# EAGLE design termometr (1) (EAGLE 7.4.0)
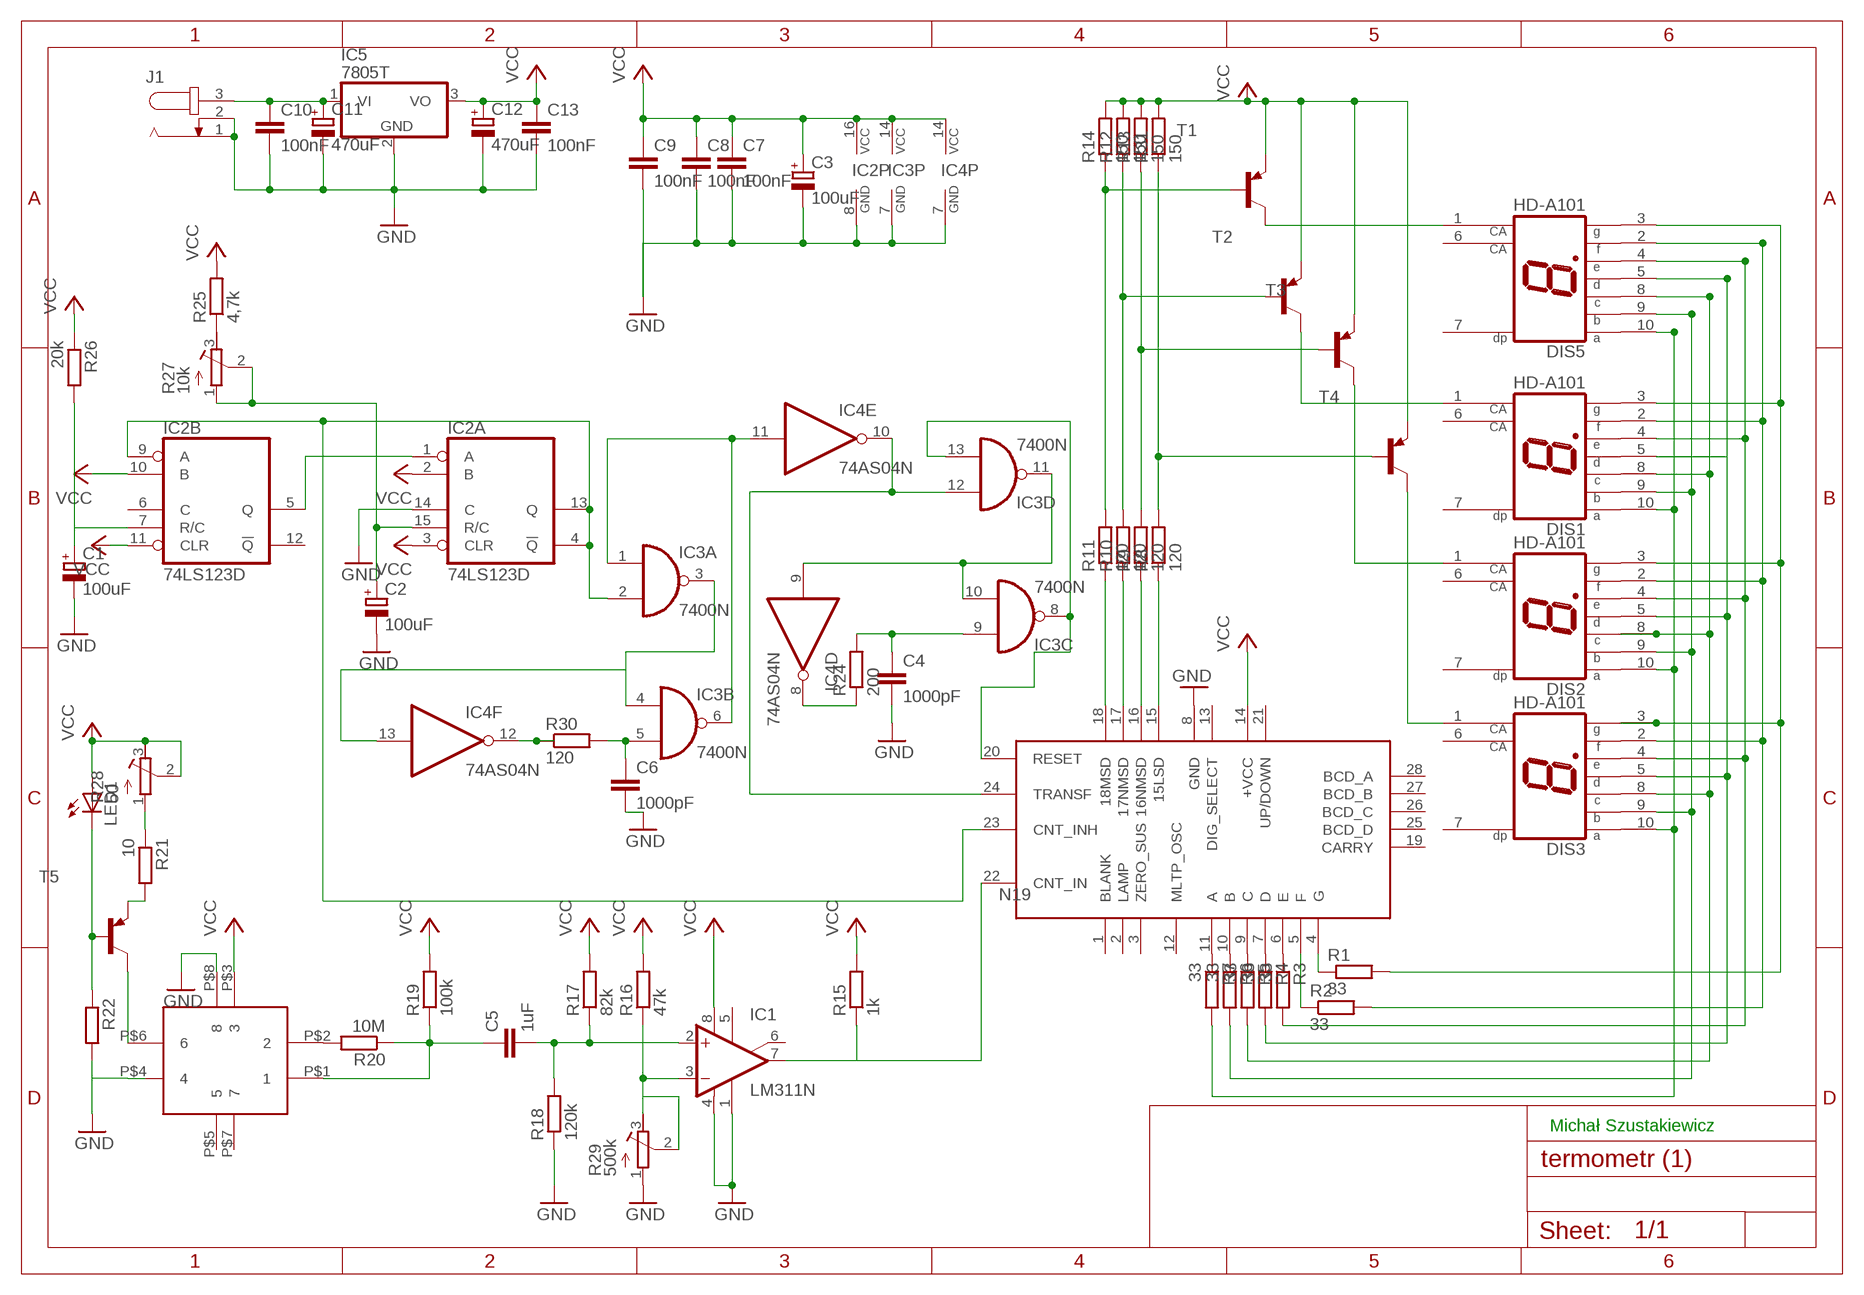
[diagram p0: schematic, sheet 1]

## Parts
C1  100uF  CPOL-EUE2.5-5  [E2,5-5]
C2  100uF  CPOL-EUE2.5-5  [E2,5-5]
C3  100uF  CPOL-EUE2.5-5  [E2,5-5]
C4  1000pF  C-EUC1206  [C1206]
C5  1uF  C-EUC1206  [C1206]
C6  1000pF  C-EUC1206  [C1206]
C7  100nF  C-EUC1206  [C1206]
C8  100nF  C-EUC1206  [C1206]
C9  100nF  C-EUC1206  [C1206]
C10  100nF  C-EUC1206  [C1206]
C11  470uF  CPOL-EUE2.5-5  [E2,5-5]
C12  470uF  CPOL-EUE2.5-5  [E2,5-5]
C13  100nF  C-EUC1206  [C1206]
DIS1  HD-A101  [HDSP-A]
DIS2  HD-A101  [HDSP-A]
DIS3  HD-A101  [HDSP-A]
DIS5  HD-A101  [HDSP-A]
IC1  LM311N  [DIL08]
IC2  74LS123D  [SO16]
IC3  7400N  [DIL14]
IC4  74AS04N  [DIL14]
IC5  7805T  [TO220H]
J1  JACK-PLUG0  [SPC4077]
LED1  LED5MM  [LED5MM]
R1  33  R-EU_M1206  [M1206]
R2  33  R-EU_M1206  [M1206]
R3  33  R-EU_M1206  [M1206]
R4  33  R-EU_M1206  [M1206]
R5  33  R-EU_M1206  [M1206]
R6  33  R-EU_M1206  [M1206]
R7  33  R-EU_M1206  [M1206]
R8  120  R-EU_M1206  [M1206]
R9  120  R-EU_M1206  [M1206]
R10  120  R-EU_M1206  [M1206]
R11  120  R-EU_M1206  [M1206]
R12  150  R-EU_M1206  [M1206]
R13  150  R-EU_M1206  [M1206]
R14  150  R-EU_M1206  [M1206]
R15  1k  R-EU_M1206  [M1206]
R16  47k  R-EU_M1206  [M1206]
R17  82k  R-EU_M1206  [M1206]
R18  120k  R-EU_M1206  [M1206]
R19  100k  R-EU_M1206  [M1206]
R20  10M  R-EU_M1206  [M1206]
R21  10  R-EU_M1206  [M1206]
R22  R-EU_M1206  [M1206]
R24  200  R-EU_M1206  [M1206]
R25  4,7k  R-EU_M1206  [M1206]
R26  20k  R-EU_M1206  [M1206]
R27  10k  R-TRIMM3202  [RTRIM3202]
R28  50  R-TRIMM3202  [RTRIM3202]
R29  500k  R-TRIMM3202  [RTRIM3202]
R30  120  R-EU_M1206  [M1206]
R31  150  R-EU_M1206  [M1206]
T1  2N3906-PNP-TO92-EBC  [TO92-EBC]
T2  2N3906-PNP-TO92-EBC  [TO92-EBC]
T3  2N3906-PNP-TO92-EBC  [TO92-EBC]
T4  2N3906-PNP-TO92-EBC  [TO92-EBC]
T5  2N3906-PNP-TO92-EBC  [TO92-EBC]
U$1  ZN1040E  [ZN1040E]
U$2  HEDS_1200  [HEDS_1200]

## Nets
15: R8.2 R31.1 T4.B
16: R9.2 R13.1 T3.B
17: R10.2 R12.1 T2.B
18: R11.2 R14.1 T1.B
GND: C1.- C2.- C3.- C4.2 C6.2 C7.2 C8.2 C9.2 C10.2 C11.- C12.- C13.2 IC1.1(GND) IC1.4(V-) IC2.8(P:GND) IC2.14(A:C) IC3.7(P:GND) IC4.7(P:GND) IC5.2(GND) J1.1 J1.2 R18.1 R22.2 R29.1(A) U$1.8(GND) U$2.P$4 U$2.P$8
N19: IC2.4(A:!Q) IC2.9(B:A) IC2.13(A:Q) IC3.2(A:I1) U$1.23(CNT_INH)
N$1: IC3.10(C:I1) IC3.11(D:O) IC4.9(D:I)
N$2: LED1.K(C) R22.1 T5.B
N$3: C1.+ IC2.7(B:R/C) R26.2
N$4: R21.1 R28.1(A)
N$5: R21.2 T5.E
N$6: C5.2 IC1.2(+IN) R17.1 R18.2
N$7: IC1.3(-IN) R16.1 R29.2(S) R29.3(E)
N$8: C5.1 R19.1 R20.1 U$2.P$1
N$9: R20.2 U$2.P$2
N$10: IC1.7(OUT) R15.1 U$1.22(CNT_IN)
N$11: C6.1 IC3.5(B:I1) R30.2
N$12: IC4.12(F:O) R30.1
N$13: C4.1 IC3.9(C:I0) R24.2
N$14: IC4.8(D:O) R24.1
N$15: C10.1 C11.+ IC5.1(VI) J1.3
N$16: IC3.1(A:I0) IC3.6(B:O) IC4.11(E:I)
N$17: IC3.12(D:I0) IC4.10(E:O) U$1.24(TRANSF)
N$18: DIS1.10(A) DIS2.10(A) DIS3.10(A) DIS5.10(A) R7.2
N$19: R1.1 U$1.4(G)
N$20: C2.+ IC2.15(A:R/C) R27.1(A) R27.2(S)
N$21: R25.1 R27.3(E)
N$22: DIS1.9(B) DIS2.9(B) DIS3.9(B) DIS5.9(B) R6.2
N$23: R2.1 U$1.5(F)
N$24: IC3.3(A:O) IC3.4(B:I0) IC4.13(F:I)
N$25: IC2.1(A:A) IC2.5(B:Q)
N$26: T5.C U$2.P$6
N$27: R3.1 U$1.6(E)
N$28: R4.1 U$1.7(D)
N$29: R5.1 U$1.9(C)
N$30: R6.1 U$1.10(B)
N$31: R7.1 U$1.11(A)
N$32: R11.1 U$1.18(18MSD)
N$33: R10.1 U$1.17(17NMSD)
N$34: R9.1 U$1.16(16NMSD)
N$35: R8.1 U$1.15(15LSD)
N$36: DIS1.8(C) DIS2.8(C) DIS3.8(C) DIS5.8(C) R5.2
N$37: DIS1.5(D) DIS2.5(D) DIS3.5(D) DIS5.5(D) R4.2
N$38: DIS1.4(E) DIS2.4(E) DIS3.4(E) DIS5.4(E) R3.2
N$39: DIS1.2(F) DIS2.2(F) DIS3.2(F) DIS5.2(F) R2.2
N$40: DIS1.3(G) DIS2.3(G) DIS3.3(G) DIS5.3(G) R1.2
N$41: DIS3.1(CA) T4.C
N$42: DIS2.1(CA) T3.C
N$43: DIS1.1(CA) T2.C
N$44: DIS5.1(CA) T1.C
RESET: IC3.8(C:O) IC3.13(D:I1) U$1.20(RESET)
VCC: C3.+ C7.1 C8.1 C9.1 C12.+ C13.1 IC1.8(V+) IC2.2(A:B) IC2.3(A:CLR) IC2.10(B:B) IC2.11(B:CLR) IC2.16(P:VCC) IC3.14(P:VCC) IC4.14(P:VCC) IC5.3(VO) LED1.A R12.2 R13.2 R14.2 R15.2 R16.2 R17.2 R19.2 R25.2 R26.1 R28.2(S) R28.3(E) R31.2 T1.E T2.E T3.E T4.E U$1.14(+VCC) U$2.P$3
Unconnected: DIS1.6(CA) DIS1.7(DP) DIS2.6(CA) DIS2.7(DP) DIS3.6(CA) DIS3.7(DP) DIS5.6(CA) DIS5.7(DP) IC1.5(ON) IC1.6(ON/STR) IC2.6(B:C) IC2.12(B:!Q) IC4.1(A:I) IC4.2(A:O) IC4.3(B:I) IC4.4(B:O) IC4.5(C:I) IC4.6(C:O) U$1.1(BLANK) U$1.2(LAMP) U$1.3(ZERO_SUS) U$1.12(MLTP_OSC) U$1.13(DIG_SELECT) U$1.19(CARRY) U$1.21(UP/DOWN) U$1.25(BCD_D) U$1.26(BCD_C) U$1.27(BCD_B) U$1.28(BCD_A) U$2.P$5 U$2.P$7

## Notes on the sheet
- Michał Szustakiewicz

## Library data of the parts
C1-C3 C11 C12 = rcl:CPOL-EU: POLARIZED CAPACITOR, European symbol
C4-C10 C13 = rcl:C-EU: CAPACITOR, European symbol
DIS1-DIS3 DIS5 = display-hp:HD-A101: LED DISPLAY 1-character 7 segment, decimal point right; OC_FARNELL: unknown; OC_NEWARK: unknown
IC1 = linear:LM311: COMPARATOR
IC2 = 74xx-eu:74*123: Retriggerable monostable MULTIVIBRATOR
IC3 = 74xx-eu:74*00: Quad 2-input NAND gate
IC4 = 74xx-eu:74*04: Hex INVERTER
IC5 = linear:78*: Positive VOLTAGE REGULATOR Source: http://cache.national.com/ds/LM/LM78L05.pdf http://www.fairchildsemi.com/ds/LM/LM7805.pdf
J1 = con-jack:JACK-PLUG: DC POWER JACK Power Jack, DC, Right Angle, Through Hole, Rated 5A at 16VDC, PC Terminals Distributor: Farnell (www.Farnell.de) Drawing: 84N1161.pdf / 84N1162.pdf Manufacturer: SPC Technology (www.spctechnology.com) Type: SPC4077 / SPC 4078; OC_FARNELL: unknown; OC_NEWARK: unknown
LED1 = led:LED: LED OSRAM: - CHIPLED LG R971, LG N971, LY N971, LG Q971, LY Q971, LO R971, LY R971 LH N974, LH R974 LS Q976, LO Q976, LY Q976 LO Q996 - Hyper CHIPLED LW Q18S LB Q993, LB Q99A, LB R99A - SideLED LS A670, LO A670, LY A670, LG A670, LP A670 LB A673, LV A673, LT A673, LW A673 LH A674 LY A675 LS A676, LA A676, LO A676, LY A676, LW A676 LS A679, LY A679, LG A679 - Hyper Micro SIDELED® LS Y876, LA Y876, LO Y876, LY Y876 LT Y87S - SmartLED LW L88C, LW L88S LB L89C, LB L89S, LG L890 LS L89K, LO L89K, LY L89K LS L896, LA L896, LO L896, LY L896 - TOPLED LS T670, LO T670, LY T670, LG T670, LP T670 LSG T670, LSP T670, LSY T670, LOP T670, LYG T670 LG T671, LOG T671, LSG T671 LB T673, LV T673, LT T673, LW T673 LH T674 LS T676, LA T676, LO T676, LY T676, LB T676, LH T676, LSB T676, LW T676 LB T67C, LV T67C, LT T67C, LS T67K, LO T67K, LY T67K, LW E67C LS E67B, LA E67B, LO E67B, LY E67B, LB E67C, LV E67C, LT E67C LW T67C LS T679, LY T679, LG T679 LS T770, LO T770, LY T770, LG T770, LP T770 LB T773, LV T773, LT T773, LW T773 LH T774 LS E675, LA E675, LY E675, LS T675 LS T776, LA T776, LO T776, LY T776, LB T776 LHGB T686 LT T68C, LB T68C - Hyper Mini TOPLED® LB M676 - Mini TOPLED Santana® LG M470 LS M47K, LO M47K, LY M47K Source: http://www.osram.convergy.de LUXEON: - LUMILED® LXK2-PW12-R00, LXK2-PW12-S00, LXK2-PW14-U00, LXK2-PW14-V00 LXK2-PM12-R00, LXK2-PM12-S00, LXK2-PM14-U00 LXK2-PE12-Q00, LXK2-PE12-R00, LXK2-PE12-S00, LXK2-PE14-T00, LXK2-PE14-U00 LXK2-PB12-K00, LXK2-PB12-L00, LXK2-PB12-M00, LXK2-PB14-N00, LXK2-PB14-P00, LXK2-PB14-Q00 LXK2-PR12-L00, LXK2-PR12-M00, LXK2-PR14-Q00, LXK2-PR14-R00 LXK2-PD12-Q00, LXK2-PD12-R00, LXK2-PD12-S00 LXK2-PH12-R00, LXK2-PH12-S00 LXK2-PL12-P00, LXK2-PL12-Q00, LXK2-PL12-R00 Source: www.luxeon.com KINGBRIGHT: KA-3528ASYC Source: www.kingbright.com
R1-R22 R24-R26 R30 R31 = rcl:R-EU_: RESISTOR, European symbol
R27-R29 = rcl:R-TRIMM: Trimm resistor
T1-T5 = transistor-neu-to92:*-PNP-: PNP Transistror
U$1 = zn1040e (1):ZN1040E
U$2 = heds_1200:HEDS_1200

## Net classes
0 default: width 0.4 mm, clearance 0.4 mm

## Board
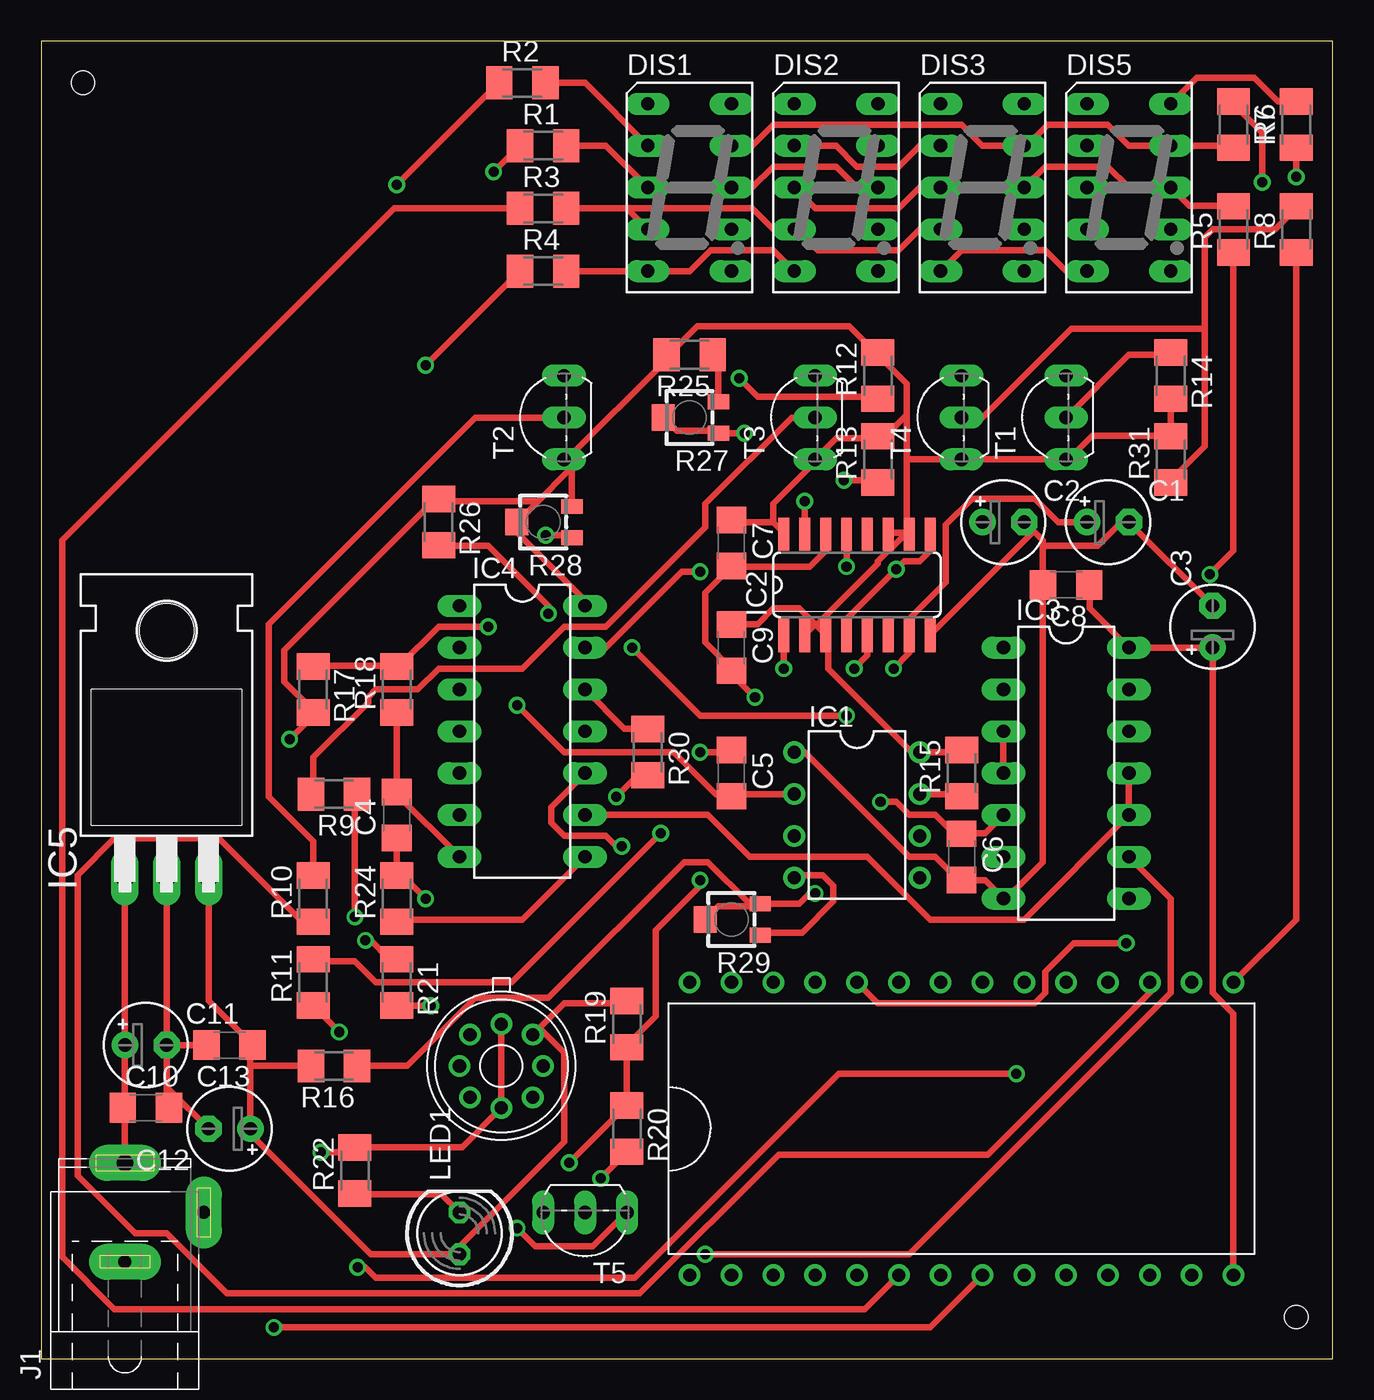
[diagram p1: board, top side]
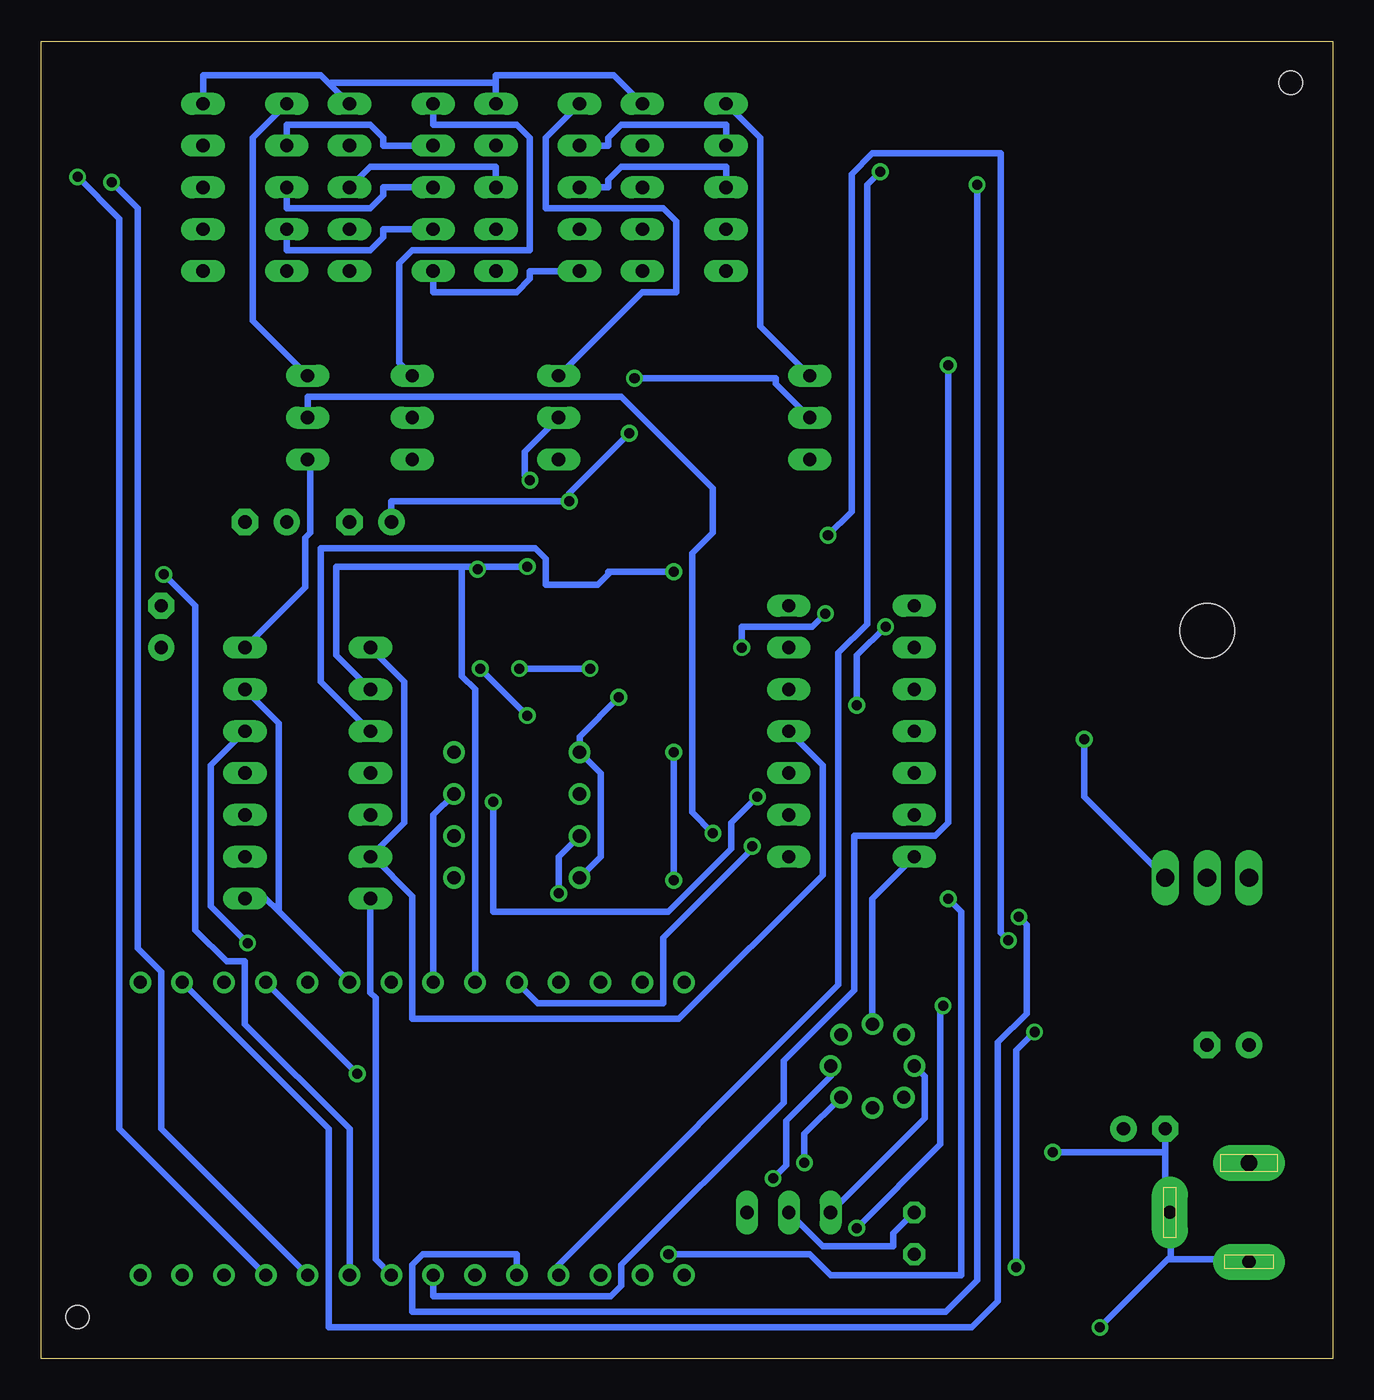
[diagram p2: board, bottom side, seen from below]

Size 78.41 x 80 mm. Coordinates in mm from the lower left corner, seen from the top.
Outline: 0,0 78.41,0 78.41,80 0,80 0,0
Copper layers (1*16): Top 0.035mm / dielectric 1.5mm / Bottom 0.035mm
Design rules "default": minimum track width 10mil, minimum drill 24mil, track to track 8mil, track to pad 8mil, pad to pad 8mil, via to via 8mil, smd to smd 8mil, copper to edge 40mil, drill to drill 8mil, minimum pad ring 10mil, minimum via ring 8mil, stop-mask expansion 4mil, vias tented up to drill 0mil, thermal gap 10mil
Holes 1.4 mm at 2.54,77.47 76.2,2.54

### Footprints (pad centres in the part's own frame; a part is rotated, then mirrored left to right if it is on the bottom)
E2,5-5 = drill 0.813 pad 1.6: + -1.27,0 | drill 0.813 pad 1.6 octagon: - 1.27,0
C1206 = smd 1.6 x 1.8: 1 -1.4,0; 2 1.4,0
HDSP-A = drill 0.813 long: 1 -2.54,5.08; 2 -2.54,2.54; 3 -2.54,0; 4 -2.54,-2.54; 5 -2.54,-5.08; 6 2.54,-5.08; 7 2.54,-2.54; 8 2.54,0; 9 2.54,2.54; 10 2.54,5.08
DIL08 = drill 0.813 pad 1.27: 1 -3.81,-3.81; 2 -1.27,-3.81; 3 1.27,-3.81; 4 3.81,-3.81; 5 3.81,3.81; 6 1.27,3.81; 7 -1.27,3.81; 8 -3.81,3.81
SO16 = smd 0.66 x 2.032: 1 -4.445,-3.073; 2 -3.175,-3.073; 3 -1.905,-3.073; 4 -0.635,-3.073; 5 0.635,-3.073; 6 1.905,-3.073; 7 3.175,-3.073; 8 4.445,-3.073; 9 4.445,3.073; 10 3.175,3.073; 11 1.905,3.073; 12 0.635,3.073; 13 -0.635,3.073; 14 -1.905,3.073; 15 -3.175,3.073; 16 -4.445,3.073
DIL14 = drill 0.813 long: 1 -7.62,-3.81; 2 -5.08,-3.81; 3 -2.54,-3.81; 4 0,-3.81; 5 2.54,-3.81; 6 5.08,-3.81; 7 7.62,-3.81; 8 7.62,3.81; 9 5.08,3.81; 10 2.54,3.81; 11 0,3.81; 12 -2.54,3.81; 13 -5.08,3.81; 14 -7.62,3.81
TO220H = drill 1.118 long: 1 -2.54,-10.16; 2 0,-10.16; 3 2.54,-10.16 | hole 3.302: 0,4.826
SPC4077 = drill 0.8 pad 2.184 long: 1 -3,0; 2 0,-4.8 | drill 1 pad 2.184 long: 3 3,0
LED5MM = drill 0.813 octagon: A -1.27,0; K 1.27,0
M1206 = smd 1.6 x 2: 1 -1.4,0; 2 1.4,0
RTRIM3202 = smd 0.9 x 1.3: 1 -0.95,-1.75; 3 0.95,-1.75 | smd 1.6 x 1.4: 2 0,1.6
TO92-EBC = drill 0.813 long: B 0,-1.27; C 2.54,-1.27; E -2.54,-1.27
ZN1040E = drill 0.8: 1 1.27,-1.27; 2 3.81,-1.27; 3 6.35,-1.27; 4 8.89,-1.27; 5 11.43,-1.27; 6 13.97,-1.27; 7 16.51,-1.27; 8 19.05,-1.27; 9 21.59,-1.27; 10 24.13,-1.27; 11 26.67,-1.27; 12 29.21,-1.27; 13 31.75,-1.27; 14 34.29,-1.27; 15 34.29,16.51; 16 31.75,16.51; 17 29.21,16.51; 18 26.67,16.51; 19 24.13,16.51; 20 21.59,16.51; 21 19.05,16.51; 22 16.51,16.51; 23 13.97,16.51; 24 11.43,16.51; 25 8.89,16.51; 26 6.35,16.51; 27 3.81,16.51; 28 1.27,16.51
HEDS_1200 = drill 0.8: P$1 -1.905,1.905; P$2 -2.54,0; P$3 -1.905,-1.905; P$4 0,-2.54; P$5 1.905,-1.905; P$6 2.54,0; P$7 1.905,1.905; P$8 0,2.54

### Placement (x,y rotation side)
C1  64.77,50.8 0 top
C2  58.42,50.8 0 top
C3  71.12,44.45 90 top
C4  21.59,33.02 90 top
C5  41.91,35.56 270 top
C6  55.88,30.48 270 top
C7  41.91,49.53 270 top
C8  62.23,46.99 180 top
C9  41.91,43.18 270 top
C10  6.35,15.24 0 top
C11  6.35,19.05 0 top
C12  11.43,13.97 180 top
C13  11.43,19.05 180 top
DIS1  39.37,71.12 0 top
DIS2  48.26,71.12 0 top
DIS3  57.15,71.12 0 top
DIS5  66.04,71.12 0 top
IC1  49.53,33.02 270 top
IC2  49.53,46.99 0 top
IC3  62.23,35.56 270 top
IC4  29.21,38.1 270 top
IC5  7.62,39.37 0 top
J1  5.08,8.89 90 top
LED1  25.4,7.62 90 top
R1  30.48,73.66 0 top
R2  29.21,77.47 0 top
R3  30.48,69.85 0 top
R4  30.48,66.04 0 top
R5  72.39,68.58 90 top
R6  72.39,74.93 270 top
R7  76.2,74.93 90 top
R8  76.2,68.58 90 top
R9  17.78,34.29 180 top
R10  16.51,27.94 90 top
R11  16.51,22.86 90 top
R12  50.8,59.69 90 top
R13  50.8,54.61 90 top
R14  68.58,59.69 270 top
R15  55.88,35.56 90 top
R16  17.78,17.78 180 top
R17  16.51,40.64 270 top
R18  21.59,40.64 90 top
R19  35.56,20.32 90 top
R20  35.56,13.97 270 top
R21  21.59,22.86 270 top
R22  19.05,11.43 90 top
R24  21.59,27.94 90 top
R25  39.37,60.96 180 top
R26  24.13,50.8 270 top
R27  39.37,57.15 90 top
R28  30.48,50.8 90 top
R29  41.91,26.67 90 top
R30  36.83,36.83 270 top
R31  68.58,54.61 90 top
T1  60.96,57.15 90 top
T2  30.48,57.15 90 top
T3  45.72,57.15 90 top
T4  54.61,57.15 90 top
T5  33.02,7.62 180 top
U$1  38.1,6.35 0 top
U$2  27.94,17.78 180 top

### Tracks (layer width: path | path; a pad name or v marks a point on that pad's centre or on a via)
15
  Top 0.4: 70.64,62.55 70.64,68.1 71.12,68.58 74.93,68.58 76.2,69.85 R8.2 | 70.64,62.55 70.64,55.4 68.58,53.34 R31.1 | T4.B 57.15,57.15 62.55,62.55 70.64,62.55
16  (via drill 0.61)
  Top 0.4: T3.B 45.56,57.15 40.32,51.91 40.32,50.48 34.29,44.45 31.75,44.45 29.21,41.91 24.13,41.91 22.86,40.64 20.32,40.64 19.84,40.16 19.84,39.85 16.51,36.51 16.51,34.29 R9.2 | v48.74,53.34 50.8,53.34 R13.1
  Bottom 0.4: v48.74,53.34 49.05,53.66 49.05,55.09 T3.B
17  (via drill 0.61)
  Top 0.4: R10.2 16.51,31.43 13.81,34.13 13.81,44.61 26.35,57.15 T2.B | v42.39,59.53 43.5,58.42 50.8,58.42 R12.1
  Bottom 0.4: v42.39,59.53 33.81,59.53 33.81,59.21 T2.B
18  (via drill 0.61)
  Top 0.4: v37.62,31.91 28.57,22.86 20.32,22.86 19.05,24.13 16.51,24.13 R11.2 | T1.B 66.04,60.96 68.58,60.96 R14.1
  Bottom 0.4: v37.62,31.91 38.89,33.18 38.89,48.9 37.62,50.16 37.62,52.86 43.18,58.42 62.23,58.42 T1.B
GND  (via drill 0.61)
  Top 0.4: C11.- 7.62,16.35 | 7.62,16.35 7.62,15.24 C10.2 | C11.- C13.2 | C12.- 7.78,16.35 7.62,16.35 | C11.- IC5.2 | R18.1 C4.2 21.59,34.29 IC4.7 | U$2.P$4 U$2.P$8 25.56,12.86 19.05,12.86 R22.2 18.89,12.86 18.57,12.54 v16.99,12.54 | C3.- C1.- 65.56,50.8 64.13,49.37 60.8,49.37 | 60.8,49.37 60.8,49.69 C2.- 60.17,50.16 53.97,43.97 IC2.8 | 60.8,49.37 60.8,46.99 C8.2 60.8,46.83 60.8,30.16 58.58,27.94 IC3.7 57.31,29.05 55.88,29.05 C6.2 55.72,29.05 54.29,30.48 52.7,30.48 46.35,36.83 IC1.1 | IC2.14 47.62,49.05 46.67,48.1 42.07,48.1 C7.2 41.91,48.1 40.32,46.51 40.32,43.5 41.91,41.91 C9.2 41.91,41.59 v43.34,40.16 | IC1.4 45.88,29.37 47.47,29.37 48.1,28.73 48.1,27.78 46.2,25.88 43.81,25.88 R29.1 | v14.13,1.91 53.97,1.91 U$1.8
  Bottom 0.4: 9.84,6.03 5.08,6.03 J1.1 | 9.84,6.03 9.84,8.89 J1.2 10,9.05 10.16,9.21 10.16,12.54 | C12.- 10.16,12.54 | IC4.7 27.94,27.94 U$2.P$4 | v16.99,12.54 10.16,12.54 | IC1.4 44.45,30.48 44.45,35.56 IC1.1 45.72,37.78 v43.34,40.16 | U$1.8 58.1,6.03 58.1,21.91 58.42,22.23 IC3.7 | v14.13,1.91 10,6.03 9.84,6.03
N19  (via drill 0.61)
  Top 0.4: IC2.4 48.89,44.93 v51.91,47.94 52.39,48.42 53.34,48.42 53.97,49.05 IC2.9 | v48.89,48.1 IC2.13
  Bottom 0.4: 52.86,48.1 60.48,48.1 60.48,42.7 IC3.2 | 52.86,48.1 51.91,48.1 | 51.91,48.1 v48.89,48.1 | U$1.23 52.07,40.64 52.86,41.43 52.86,48.1 | v51.91,47.94 51.91,48.1
N$1
  Top 0.4: IC4.9 40.48,33.02 43.02,30.48 50.16,30.48 53.97,26.67 59.69,26.67 IC3.10 IC3.11
N$2
  Top 0.4: LED1.K 24.29,10 19.05,10 R22.1
  Bottom 0.4: T5.B 30.96,6.83 26.67,6.83 26.67,7.62 LED1.K
N$3  (via drill 0.61)
  Top 0.4: v30.8,45.24 30.8,45.72 27.15,49.37 24.13,49.37 R26.2 | v35.88,43.18 40,39.05 v48.89,39.05 | v51.75,41.91 52.7,42.86 IC2.7 52.86,43.97 52.86,45.09 54.93,47.15 54.93,50.64 56.52,52.23 60.33,52.23 61.75,50.8 C1.+
  Bottom 0.4: v30.8,45.24 31.59,44.45 35.88,44.45 v35.88,43.18 | v51.75,41.91 v48.89,39.05
N$4  (via drill 0.61)
  Top 0.4: v30.64,50.01 32.23,50.01 R28.1 | v19.68,25.4 20,25.4 21.11,24.29 21.59,24.29 R21.1
  Bottom 0.4: v30.64,50.01 29.21,51.44 29.21,71.91 27.94,73.18 20.16,73.18 20.16,25.88 v19.68,25.4
N$5  (via drill 0.61)
  Top 0.4: v23.65,21.43 21.59,21.43 R21.2 | v28.89,7.94 30,6.83 33.5,6.83 T5.E
  Bottom 0.4: v23.65,21.43 23.81,21.27 23.81,13.02 v28.89,7.94
N$6  (via drill 0.61)
  Top 0.4: R17.1 16.51,42.07 21.59,42.07 R18.2 21.75,42.07 24.13,44.45 v27.15,44.45 | IC1.2 41.91,34.29 C5.2 41.75,34.29 40.96,34.29 38.42,36.83 31.75,36.83 v28.89,39.69
  Bottom 0.4: v27.15,44.45 28.89,42.7 v28.89,39.69
N$7  (via drill 0.61)
  Top 0.4: R29.3 43.66,27.46 41.12,27.46 40.32,26.67 R29.2 | R16.1 22.22,17.78 26.35,21.91 30.8,21.91 39.05,30.16 40.48,30.16 43.02,27.62 R29.3 | v46.99,28.26 46.67,28.26 46.04,27.62 43.81,27.62 R29.3
  Bottom 0.4: IC1.3 46.99,30.48 v46.99,28.26
N$8  (via drill 0.61)
  Top 0.4: v40,36.83 41.91,36.83 C5.1 | v40,29.05 40,28.73 37.31,26.04 37.31,20.8 35.56,19.05 R19.1 35.56,15.4 | 35.56,15.4 v32.07,11.91 | 35.56,15.4 R20.1
  Bottom 0.4: v40,29.05 v40,36.83 | U$2.P$1 32.07,13.65 v32.07,11.91
N$9  (via drill 0.61)
  Top 0.4: v33.97,10.95 35.56,12.54 R20.2
  Bottom 0.4: v33.97,10.95 33.18,11.75 33.18,14.45 30.48,17.14 U$2.P$2
N$10
  Top 0.4: IC1.7 55.88,34.29 R15.1
  Bottom 0.4: U$1.22 54.61,33.02 IC1.7
N$11  (via drill 0.61)
  Top 0.4: IC3.5 57.31,31.91 55.88,31.91 C6.1 55.72,31.91 55.4,31.91 54.29,33.02 52.7,33.02 51.91,33.81 v50.96,33.81 | v34.92,34.13 36.19,35.4 36.83,35.4 R30.2
  Bottom 0.4: v34.92,34.13 36.51,32.54 36.51,30.96 40.32,27.15 50.96,27.15 v50.96,33.81
N$12
  Top 0.4: IC4.12 35.4,38.26 36.83,38.26 R30.1
N$13  (via drill 0.61)
  Top 0.4: C4.1 R24.2 21.75,29.53 v23.34,27.94 | IC3.9 68.58,27.94 68.58,22.23 52.7,6.35 v40.32,6.35
  Bottom 0.4: v40.32,6.35 31.75,6.35 30.48,5.08 22.54,5.08 22.54,27.15 v23.34,27.94
N$14
  Top 0.4: IC4.8 29.21,26.67 21.59,26.67 R24.1
N$15
  Top 0.4: J1.3 5.08,15.24 C10.1 5.08,15.4 C11.+ IC5.1
N$16
  Bottom 0.4: IC3.1 56.36,41.12 56.36,32.54 IC3.6 58.26,30.48 55.88,28.1 55.88,20.64 39.69,20.64 30.96,29.37 30.96,36.04 IC4.11
N$17  (via drill 0.61)
  Top 0.4: v35.24,31.11 34.92,31.11 34.29,31.75 31.75,31.75 30.96,32.54 30.96,33.5 IC4.10 | v65.88,25.24 62.71,25.24 60.96,23.5 60.96,22.23 60.33,21.59 50.8,21.59 U$1.24
  Bottom 0.4: U$1.24 48.26,21.59 40.64,21.59 40.64,25.56 35.24,30.96 v35.24,31.11 | IC3.12 68.1,36.04 68.1,27.46 v65.88,25.24
N$18
  Top 0.4: DIS5.10 70.17,77.79 73.66,77.79 75.09,76.36 76.2,76.36 R7.2
  Bottom 0.4: DIS1.10 43.66,77.95 50.8,77.95 50.8,77.47 | DIS2.10 50.8,77.47 | 60.88,77.39 61.44,77.95 68.58,77.95 DIS5.10 | 60.88,77.39 DIS3.10 | 50.8,77.47 60.8,77.47 60.88,77.39
N$19  (via drill 0.61)
  Top 0.4: v27.46,72.07 29.05,73.66 R1.1
  Bottom 0.4: v27.46,72.07 28.26,71.28 28.26,44.61 30,42.86 30,22.7 46.99,5.71 U$1.4
N$20  (via drill 0.61)
  Top 0.4: R27.2 37.78,57.15 38.58,56.36 41.12,56.36 R27.1 41.28,56.2 v42.7,56.2 | v46.35,52.07 IC2.15
  Bottom 0.4: C2.+ 57.15,52.07 v46.35,52.07 46.35,52.55 v42.7,56.2
N$21
  Top 0.4: R27.3 41.12,60.64 40.8,60.96 R25.1
N$22
  Top 0.4: R6.2 72.39,73.66 DIS5.9 66.04,73.66 64.77,74.93 61.12,74.93 59.85,73.66 DIS3.9 57.15,73.66 55.88,74.93 49.53,74.93 | DIS1.9 43.18,73.66 44.45,74.93 49.53,74.93 | DIS2.9 49.53,74.93
N$23  (via drill 0.61)
  Top 0.4: v21.59,71.28 27.78,77.47 R2.1
  Bottom 0.4: v21.59,71.28 21.59,4.76 23.5,2.86 55.88,2.86 55.88,5.71 55.24,6.35 49.53,6.35 U$1.5
N$24  (via drill 0.61)
  Top 0.4: IC3.3 IC3.4 | IC4.13 34.29,43.18 38.89,47.78 v40,47.78
  Bottom 0.4: v40,47.78 43.97,47.78 43.97,47.62 44.61,46.99 47.78,46.99 47.78,48.58 48.42,49.21 61.44,49.21 61.44,41.12 IC3.3
N$25  (via drill 0.61)
  Top 0.4: v45.08,41.91 IC2.1 | v49.37,41.91 50.16,42.7 IC2.5
  Bottom 0.4: v49.37,41.91 v45.08,41.91
N$26
  Bottom 0.4: U$2.P$6 24.76,17.14 24.76,14.61 T5.C
N$27
  Top 0.4: 1.27,49.69 1.27,6.19 4.45,3.02 50.01,3.02 U$1.6 | 29.05,69.85 R3.1
  Top 0.406: 1.27,49.69 21.43,69.85 R3.1
N$28  (via drill 0.61)
  Top 0.4: v23.34,60.33 29.05,66.04 R4.1
  Bottom 0.4: v23.34,60.33 23.34,32.54 24.13,31.75 29.05,31.75 29.05,22.38 33.34,18.1 33.34,15.56 43.18,5.71 43.18,4.45 43.81,3.81 54.61,3.81 U$1.7
N$29  (via drill 0.61)
  Top 0.4: R5.1 72.39,49.05 v70.96,47.62
  Bottom 0.4: v70.96,47.62 69.06,45.72 69.06,26.04 67.15,24.13 66.04,24.13 66.04,20.32 59.69,13.97 U$1.9
N$30  (via drill 0.61)
  Top 0.4: v74.14,71.44 74.14,74.45 72.39,76.2 R6.1
  Bottom 0.4: v74.14,71.44 72.55,69.85 72.55,24.92 71.12,23.5 71.12,13.97 U$1.10
N$31  (via drill 0.61)
  Top 0.4: v76.2,71.75 R7.1
  Bottom 0.4: v76.2,71.75 73.66,69.22 73.66,13.97 U$1.11
N$32  (via drill 0.61)
  Top 0.4: v18.1,19.84 16.51,21.43 R11.1 | v19.21,5.56 19.68,5.56 20.32,4.92 36.04,4.92 48.42,17.3 v59.21,17.3
  Bottom 0.4: v18.1,19.84 19.21,18.73 v19.21,5.56 | U$1.18 v59.21,17.3
N$33
  Top 0.4: U$1.17 67.31,22.23 57.47,12.38 44.77,12.38 36.35,3.97 11.27,3.97 7.62,7.62 5.71,7.62 2.22,11.11 2.22,29.37 4.45,31.59 10.79,31.59 15.72,26.67 16.51,26.67 R10.1
N$34  (via drill 0.61)
  Top 0.4: v19.05,26.83 19.05,34.29 R9.1
  Bottom 0.4: v19.05,26.83 18.57,26.35 18.57,20.95 20.32,19.21 20.32,3.49 21.91,1.91 60.96,1.91 60.96,13.97 U$1.16
N$35
  Top 0.4: R8.1 76.2,26.67 U$1.15
N$36
  Top 0.4: R5.2 72.39,70.01 69.69,70.01 DIS5.8 66.04,71.12 64.77,72.39 60.96,72.39 DIS3.8 | DIS1.8 43.18,71.12 44.45,72.39 48.26,72.39 49.53,71.12 DIS2.8
  Bottom 0.4: DIS3.8 58.42,72.39 50.8,72.39 DIS2.8
N$37
  Top 0.4: R4.2 DIS1.5 39.37,66.04 40.64,67.31 44.45,67.31 DIS2.5 | DIS5.5 62.23,66.04 60.96,67.31 55.88,67.31 DIS3.5
  Bottom 0.4: DIS2.5 48.74,66.04 48.74,65.56 49.53,64.77 54.61,64.77 DIS3.5
N$38
  Top 0.4: 35.56,69.85 R3.2 | DIS1.4 35.56,69.85 | 35.56,69.85 43.18,69.85 44.45,68.58 DIS2.4 45.88,68.58 47.15,67.31 52.07,67.31 53.34,68.58 DIS3.4
  Bottom 0.4: DIS3.4 57.63,68.58 57.63,68.1 58.42,67.31 63.5,67.31 DIS5.4
N$39
  Top 0.4: R2.2 33.02,77.47 DIS1.2 | DIS3.2 53.34,73.66 52.07,72.39 49.53,72.39 48.26,73.66 DIS2.2
  Bottom 0.4: DIS3.2 57.63,73.66 57.63,74.14 58.42,74.93 63.5,74.93 DIS5.2 | DIS2.2 43.97,73.66 43.97,74.14 43.18,74.93 36.83,74.93 DIS1.2
N$40
  Top 0.4: R1.2 34.29,73.66 DIS1.3 | DIS3.3 53.34,71.12 52.07,69.85 46.99,69.85 DIS2.3
  Bottom 0.4: DIS3.3 57.63,71.12 57.63,70.64 58.42,69.85 63.5,69.85 DIS5.3 | DIS2.3 43.97,71.12 43.97,71.6 43.18,72.39 36.83,72.39 DIS1.3
N$41
  Bottom 0.4: T4.C 56.67,60.48 56.67,66.52 55.88,67.31 48.74,67.31 48.74,74.14 49.53,74.93 54.61,74.93 DIS3.1
N$42
  Bottom 0.4: T3.C 41.91,64.77 39.85,64.77 39.85,69.06 40.64,69.85 47.78,69.85 47.78,74.14 DIS2.1
N$43
  Bottom 0.4: T2.C 34.77,62.71 34.77,74.14 DIS1.1
N$44
  Bottom 0.4: T1.C 65.56,63.02 65.56,74.14 DIS5.1
RESET
  Bottom 0.4: 64.06,27.23 64.77,27.94 IC3.8 | 64.06,27.23 U$1.20 | IC3.13 63.98,38.58 63.98,27.3 64.06,27.23
VCC  (via drill 0.61)
  Top 0.4: C8.1 63.66,46.99 63.66,45.56 IC3.14 C3.+ 71.12,22.23 72.39,20.95 U$1.14 | R19.2 35.56,21.59 31.75,21.59 U$2.P$3 30.32,20 31.75,18.57 31.75,13.18 25.08,6.51 LED1.A 20,6.35 12.7,13.65 C12.+ 12.7,17.78 | 12.7,17.78 12.7,19.05 C13.1 12.7,19.21 10.16,21.75 IC5.3 | 12.7,17.78 R16.2 | T2.E 32.23,54.13 R28.3 | 30.08,51.99 32.07,53.98 T2.E | 30.08,51.99 28.89,50.8 R28.2 28.89,50.64 28.89,50.16 33.02,46.04 IC4.14 | T2.E 31.91,54.61 37.94,60.64 37.94,60.96 R25.2 38.1,60.96 39.85,62.71 49.05,62.71 50.64,61.12 R12.2 50.8,60.96 52.55,59.21 52.55,57.31 | 30.08,51.99 30,52.07 24.29,52.07 R26.1 24.13,52.07 23.81,52.07 14.76,43.02 14.76,41.12 16.51,39.37 R17.2 16.51,39.05 v15.08,37.62 | R15.2 55.88,36.83 IC1.8 52.86,36.83 47.78,41.91 47.78,43.81 IC2.3 47.62,43.97 47.07,44.53 | 47.07,44.53 46.99,44.61 | 46.99,44.61 46.04,45.56 44.45,45.56 43.5,44.61 41.91,44.61 C9.1 | 46.99,44.61 46.35,43.97 IC2.2 | 44.45,50.8 41.91,50.8 C7.1 | 44.45,50.8 45.08,50.16 IC2.16 | R14.2 R31.2 68.42,56.04 63.82,56.04 62.39,54.61 T1.E T4.E 52.55,54.61 | IC2.11 51.44,50.16 52.7,50.16 IC2.10 | 52.55,57.31 51.28,56.04 50.96,56.04 R13.2 50.8,55.88 48.26,55.88 T3.E 46.99,54.45 44.45,51.91 44.45,50.8 | 52.55,57.31 52.55,54.61 | 52.55,54.61 52.55,50.32 IC2.10 | 47.07,44.53 50.8,48.26 50.8,48.42 52.39,50.01 IC2.10
  Bottom 0.4: IC5.3 15.08,34.13 v15.08,37.62 | IC3.14 62.39,46.83 62.39,49.85 62.07,50.16 62.07,54.45 T1.E